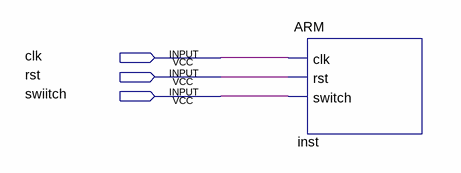
[diagram p0: schematic sheet]
// Quartus schematic Block1.bdf as structural Verilog: 1 symbols, 3 pins
module Block1 (
  input  clk,
  input  rst,
  input  swiitch
);

  ARM inst (.clk(clk), .rst(rst), .switch(swiitch));
endmodule
